# Altium schematic sheet Motion.SchDoc
size 420 x 297 mm; SheetNumber: 5; SheetTotal: 11
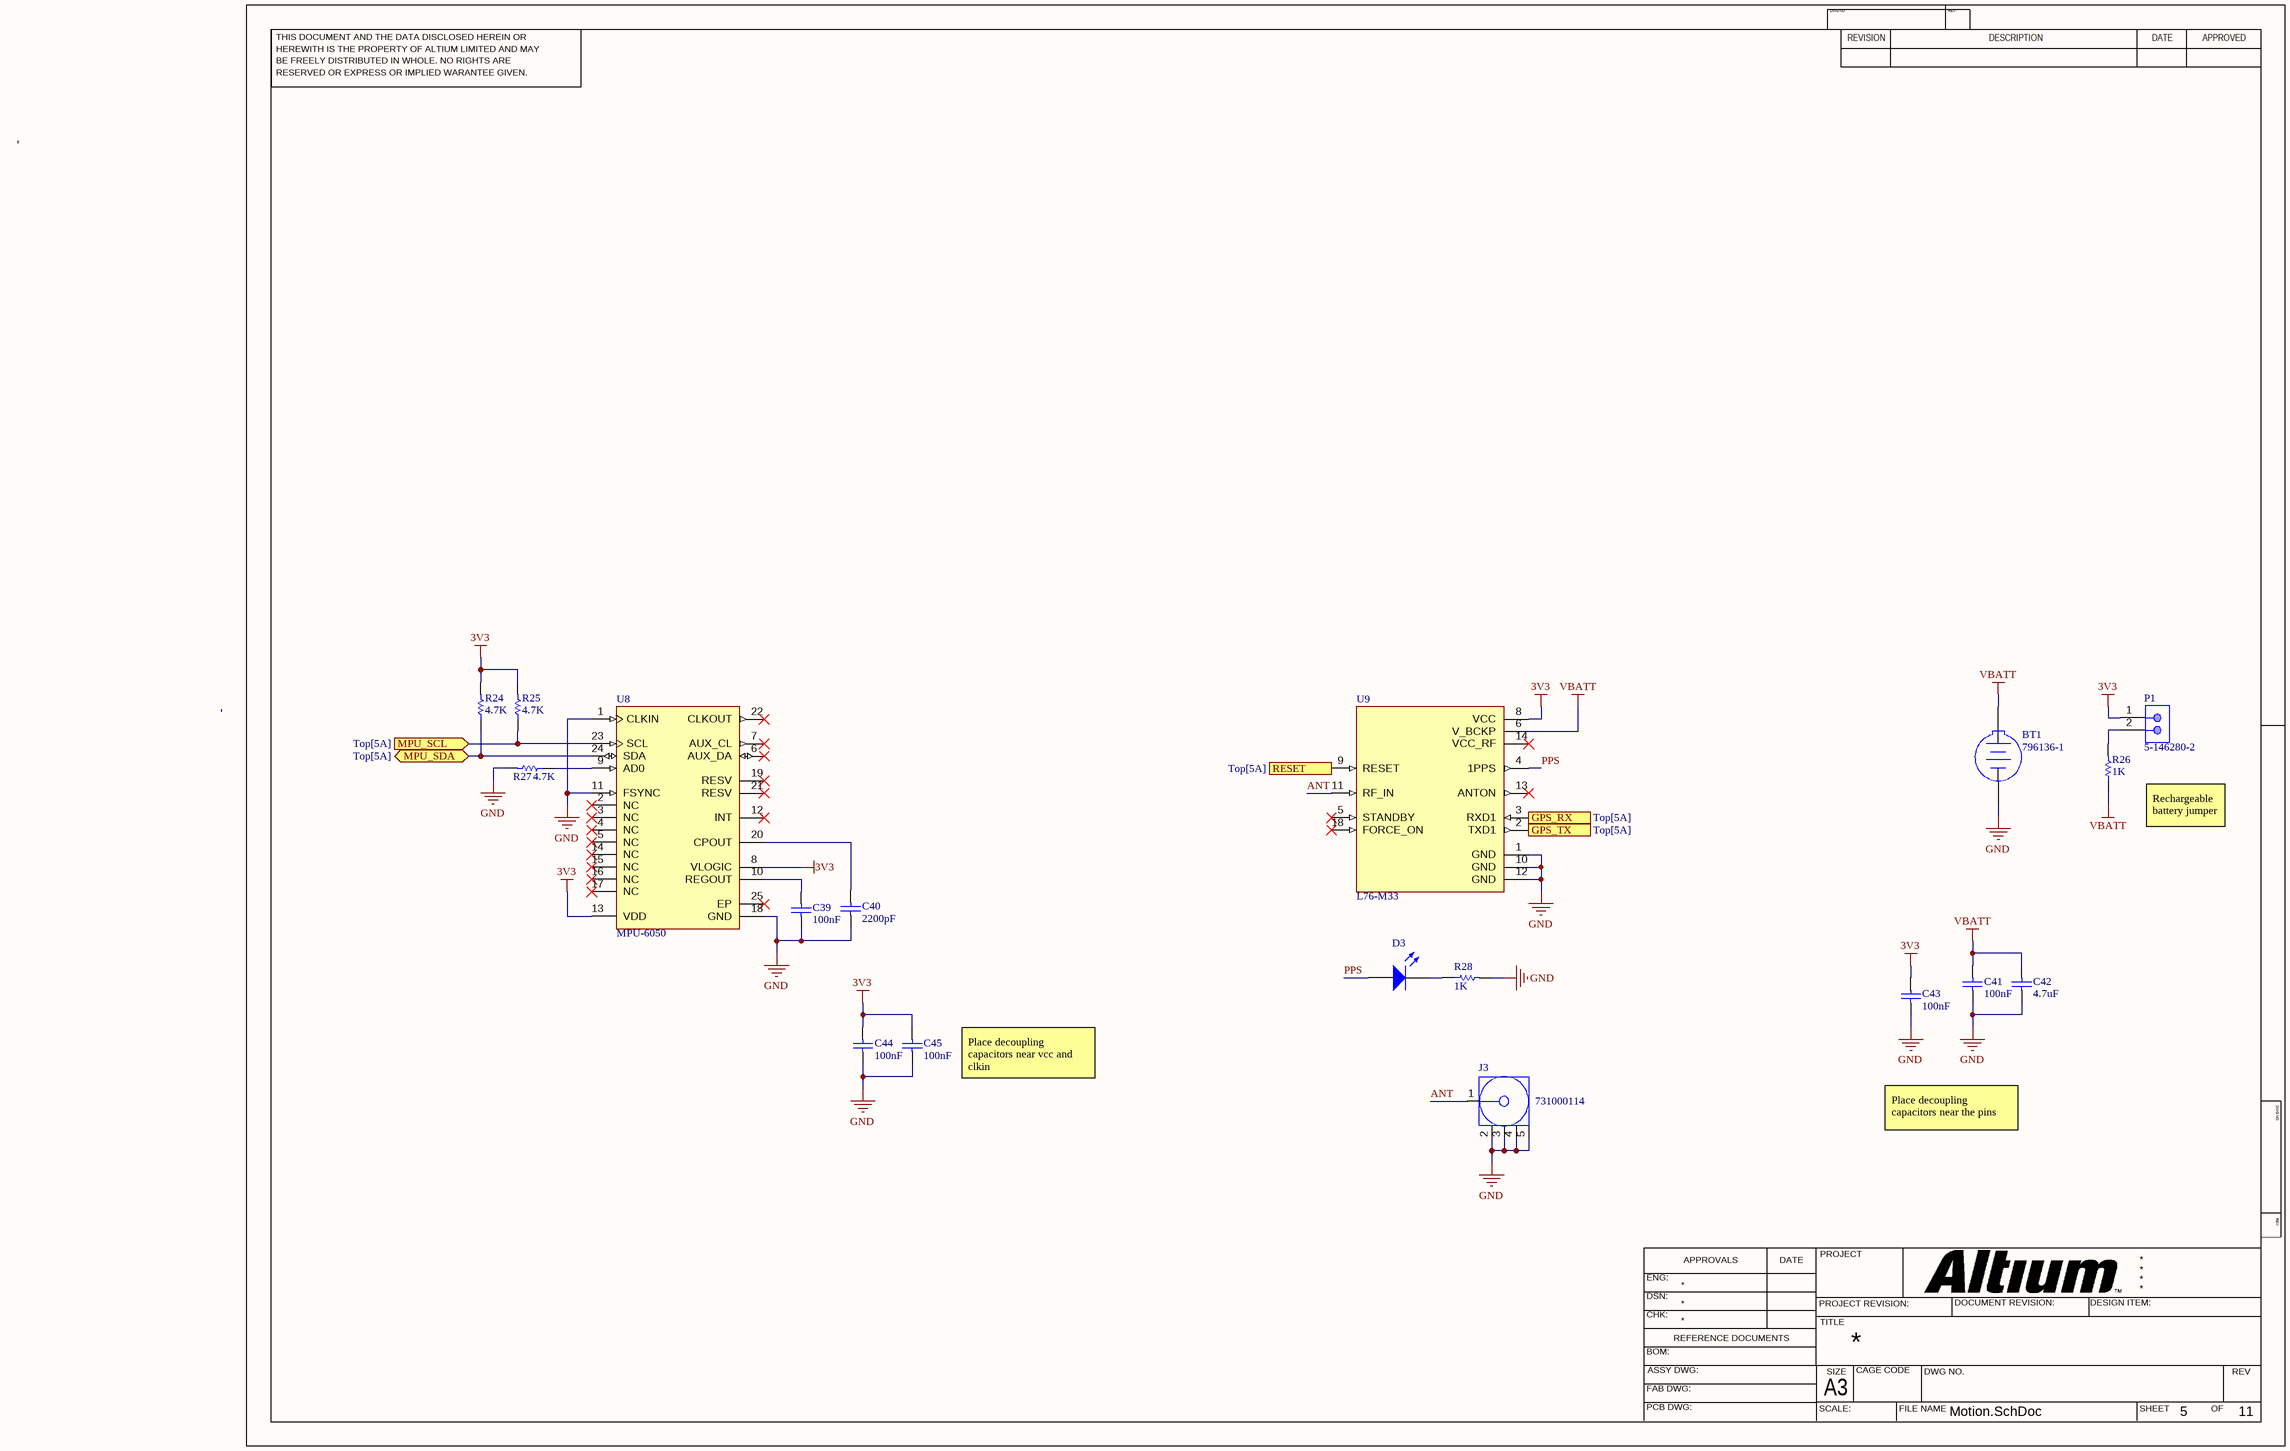
[diagram p0: Motion.SchDoc]

## Parts
BT1  796136-1  [TECO-796136-1_V]
C39  value 100nF  (hidden comment: Capacitor)
C40  value 2200pF  (hidden comment: Capacitor)
C41  value 100nF  (hidden comment: Capacitor)
C42  value 4.7uF  (hidden comment: Capacitor)
C43  value 100nF  (hidden comment: Capacitor)
C44  value 100nF  (hidden comment: Capacitor)
C45  value 100nF  (hidden comment: Capacitor)
D3  Light-Emitting Diode  (value not drawn)
J3  731000114  [MOLX-731000114_V]
P1  5-146280-2  [TECO-5-146280-2_V]
R24  value 4.7K  (hidden comment: Resistor)
R25  value 4.7K  (hidden comment: Resistor)
R26  value 1K  (hidden comment: Resistor)
R27  value 4.7K  (hidden comment: Resistor)
R28  value 1K  (hidden comment: Resistor)
U8  MPU-6050  [IS-QFN-24_V]
U9  L76-M33  [XCVR_L76-M33]

## Ports
GPS_RX (in, see Top[5A]), GPS_TX (out, see Top[5A]), MPU_SCL (in, see Top[5A]), MPU_SDA (bidir, see Top[5A]), RESET (in, see Top[5A])

## Nets
3V3: C43.2 C44.2 C45.2 P1.1 R24.2 R25.2 U8.8(VLOGIC) U8.13(VDD) U9.8(VCC)
GND: BT1.2(-) C39.1 C40.1 C41.1 C42.1 C43.1 C44.1 C45.1 J3.2 J3.3 J3.4 J3.5 R27.2 R28.2 U8.1(CLKIN) U8.11(FSYNC) U8.18(GND) U9.1(GND) U9.10(GND) U9.12(GND)
VBATT: BT1.1(+) C41.2 C42.2 R26.1 U9.6(V_BCKP)
ANT: J3.1 U9.11(RF_IN)
GPS_RX: U9.3(RXD1) ; port GPS_RX
GPS_TX: U9.2(TXD1) ; port GPS_TX
MPU_SCL: R25.1 U8.23(SCL) ; port MPU_SCL
MPU_SDA: R24.1 U8.24(SDA) ; port MPU_SDA
PPS: D3.1(A) U9.4(1PPS)
RESET: U9.9(RESET) ; port RESET
NetC39_2: C39.2 U8.10(REGOUT)
NetC40_2: C40.2 U8.20(CPOUT)
NetD3_2: D3.2(K) R28.1
NetP1_2: P1.2 R26.2
NetR27_1: R27.1 U8.9(AD0)

Not connected (* = marked no-connect by the designer): U8 2(NC)* 3(NC)* 4(NC)* 5(NC)* 6(AUX_DA)* 7(AUX_CL)* 12(INT)* 14(NC)* 15(NC)* 16(NC)* 17(NC)* 19(RESV)* 21(RESV)* 22(CLKOUT)* 25(EP)*; U9 5(STANDBY)* 13(ANTON)* 14(VCC_RF)* 18(FORCE_ON)*

## Notes on the sheet
- Rechargeable battery jumper
- Place decoupling capacitors near vcc and clkin
- Place decoupling capacitors near the pins
- THIS DOCUMENT AND THE DATA DISCLOSED HEREIN OR
- HEREWITH IS THE PROPERTY OF ALTIUM LIMITED AND MAY
- DWG NO:
- REVISION
- REV:
- DESCRIPTION
- DATE
- APPROVED
- BE FREELY DISTRIBUTED IN WHOLE. NO RIGHTS ARE
- RESERVED OR EXPRESS OR IMPLIED WARANTEE GIVEN.
- ENG:
- APPROVALS
- PROJECT
- DSN:
- CHK:
- REFERENCE DOCUMENTS
- PROJECT REVISION:
- TITLE
- DOCUMENT REVISION:
- DESIGN ITEM:
- BOM:
- FAB DWG:
- PCB DWG:
- ASSY DWG:
- SCALE:
- A3
- SIZE
- CAGE CODE
- FILE NAME
- DWG NO.
- SHEET
- OF
- REV

## Library data of the parts
BT1 = CMP-1684-00006-2: Battery Connector, 1 Cell, CR2032, 2-Pin SMD, RoHS, Tape and Reel; Case\Package: 0603; Lens Style: Diffused; Illumination Colour: Blue; Nominal Vf: 3.3 V; Luminous Intensity: 28 mcd; Forward Voltage: 2.8 V; Forward Current: 20 mA; Viewing Angle: 130 degrees; Pins: 2; Package Quantity: 3000; Case Code (Imperial): 0603; Colour: Blue; ComponentLink2Description: Datasheet; Packaging: Tape and Reel; Length: 1.6 mm; Max Operating Temperature: 80 degC; ComponentLink2URL: http://www.te.com/commerce/DocumentDelivery/DDEController?Action=srchrtrv&DocNm=796136&DocType=Customer+Drawing&DocLang=English&DocFormat=pdf&PartCntxt=796136-1; PackageReference: 796136-1; Case Code (Metric): 1608; PackageDescription: 2-Pin Surface Mount Device, Body 32.31 x 19.05 mm; ComponentLink1Description: Manufacturer URL; Mount: Surface Mount; ComponentLink1URL: http://www.te.com/; Min Operating Temperature: -20 degC; Width: 0.8 mm; DatasheetVersion: Dec-13; Radiation Hardening: No; RoHSCompliant: true; Height: 0.8 mm
C39-C45 = Capacitor: SimulationGenericComponent: True; Supplier 1: Arrow Electronics
D3 = LED: AF: 1; BV: 0; BV_MAX: 1e99; EG: 1.11; FC: 0.5; IBV: 0.001; IS: 1e-14; MJSW: 0.33; NTUN: 30; TNOM: 27; XTI: 3; SimulationGenericComponent: True; CJO: 0; CJP: 0; CTA: 0; CTP: 0; FCS: 0.5; FV_MAX: 1e99; IKF: 0; IKR: 0; ISR: 1e-14; JSW: 0; JTUN: 0; JTUNSW: 0; KEG: 1; KF: 0; LEVEL: 1; N: 1; NBV: 1; NR: 1; NS: 1; PHP: 1; RS: 0; TCV: 0; TLEV: 0; TLEVC: 0; TM1: 0; TM2: 0; TPB: 0; TPHP: 0; TRS: 0; TRS2: 0; TT: 0; TTT1: 0; TTT2: 0; VJ: 1; XTITUN: 3
J3 = CMP-2000-05487-1: SMA Right-Angle PCB Jack Receptacle, Brass Body, Gold Plated, 50 Ohm, 5-Pin THD, RoHS, Tray; Manufacturer: Molex; Datasheet Version: 09/2016; Package Description: 5-Pin Through Hole Device, Body 14.8 x 6.35 mm, Pitch 2.54 mm; Datasheet URL: http://www.molex.com/webdocs/datasheets/pdf/en-us/0731000114_RF_COAX_CONNECTORS.pdf; Manufacturer URL: http://www.molex.com/; Package Reference: 731000114; Mounting Technology: ThroughHole; Package URL: http://www.molex.com/pdm_docs/sd/731000114_sd.pdf
P1 = CMP-2000-07492-1: Male Header, Pitch 2.54 mm, 1 x 2 Position, Height 8.21 mm, Tail Length 3.05 mm, -65 to 105 degC, RoHS, Bulk; Manufacturer: TE Connectivity; Mating Connector Lock: No(Without); Number of Positions: 2; Pitch: 2.54mm; PCB Mounting Orientation: Vertical; Keyed: No; Case\/Package: 100; Mating Post Length: 0.23inch; High Temperature Housing: Yes; Max Current Rating: 5A; PCB Thickness: 0.063inch; PCB Mount Retention: Without; Approvals: CSA; Current Rating: 3A; Radiation Hardening: No; Length: 4.67mm; Contact Mating Length: 0.23inch; Connector Type: Header; Number of Rows: 1; Termination Post Length: 0.12inch; Board Standoff: No(Without); Max Operating Temperature: 105degC; Contact Shape: Square; Selectively Loaded: No(Without); Gasket: No(Without); Number of Contacts: 2; Contact Gender: Male; Mating Alignment: No(Without); Manufacturer URL: http://www.te.com/; Datasheet URL: http://www.te.com/commerce/DocumentDelivery/DDEController?Action=showdoc&DocId=Customer+Drawing%7F146280%7FH1%7Fpdf%7FEnglish%7FENG_CD_146280_H1.pdf%7F5-146280-2; Mount: ThroughHole; Orientation: Straight; Packaging: Carton; Package Reference: 5-146280-2; Package Quantity: 500; Stabilizers: No(Without); Row Spacing: 2.54mm; Contact Material: CopperAlloy; Panel Mount Retention: No(Without); Datasheet Version: Rev. H1, 08/2016; Housing Colour: Black; Colour: Black; Package Description: Male Header, Pitch 2.54 mm, 1 x 2 Position, Height 8.21 mm, Tail Length 3.05 mm; Contact Plating: Matte; Housing Material: Polymer; Contact Protection: No(Without); Min Operating Temperature: -65degC; Mounting Technology: ThroughHole; Flammability Rating: UL94V-0; RoHSCompliant: true; Termination: ThroughHole; Depth: 2.34mm; High Speed Serial Data Connector: No
R24-R28 = Resistor: TC1: 0; SimulationGenericComponent: True; TC2: 0
U8 = CMP-1753-00002-2: 3-Axis Gyroscope, Accelerometer and a Digital Motion Processor(TM) (DMP), 2.375 to 3.46 V, -40 to 85 degC, 24-Pin QFN, RoHS, Tape and Reel; Manufacturer: InvenSense; Featured Product: MPU-60506-Axis,IntegratedI²CSolution; Other Names: 1428-1007-2 / MPU6050; Sensor Type: MotionTracking; Online Catalog: MPU-6000™Series; Unit PriceUSD: Digital; Datasheet Version: Rev. 3.3, 05/2012; Category: Sensors,Transducers; Datasheet URL: http://datasheet.octopart.com/MPU-6050-InvenSense-datasheet-14421344.pdf; Family: Multifunction; Standard Package: 5,000; Manufacturer URL: http://www.invensense.com/; Output Type: Digital; Dynamic Catalog: MPU-6000™Series
U9 = CMP-009-000000-1: L76, the extremely compact GNSS module, is a concurrent GNSS receiver with multiple GNSS systems. It provides simultaneous GPS, GLONASS, BeiDou, Galileo and QZSS open service L1 reception capability.; MF: Quectel; Design Item ID: L76-M33; Value: *; MP: L76-M33; Component Type: Standard; Price: None; Availability: Unavailable; SnapEDA_Link: https://www.snapeda.com/parts/L76-M33/Quectel/view-part/235665/?ref=snap; Pin Count: 14; Package: None; Source: SnapEDAsch.SchLib